# EAGLE design Diag64Cart (EAGLE 9.6.2)
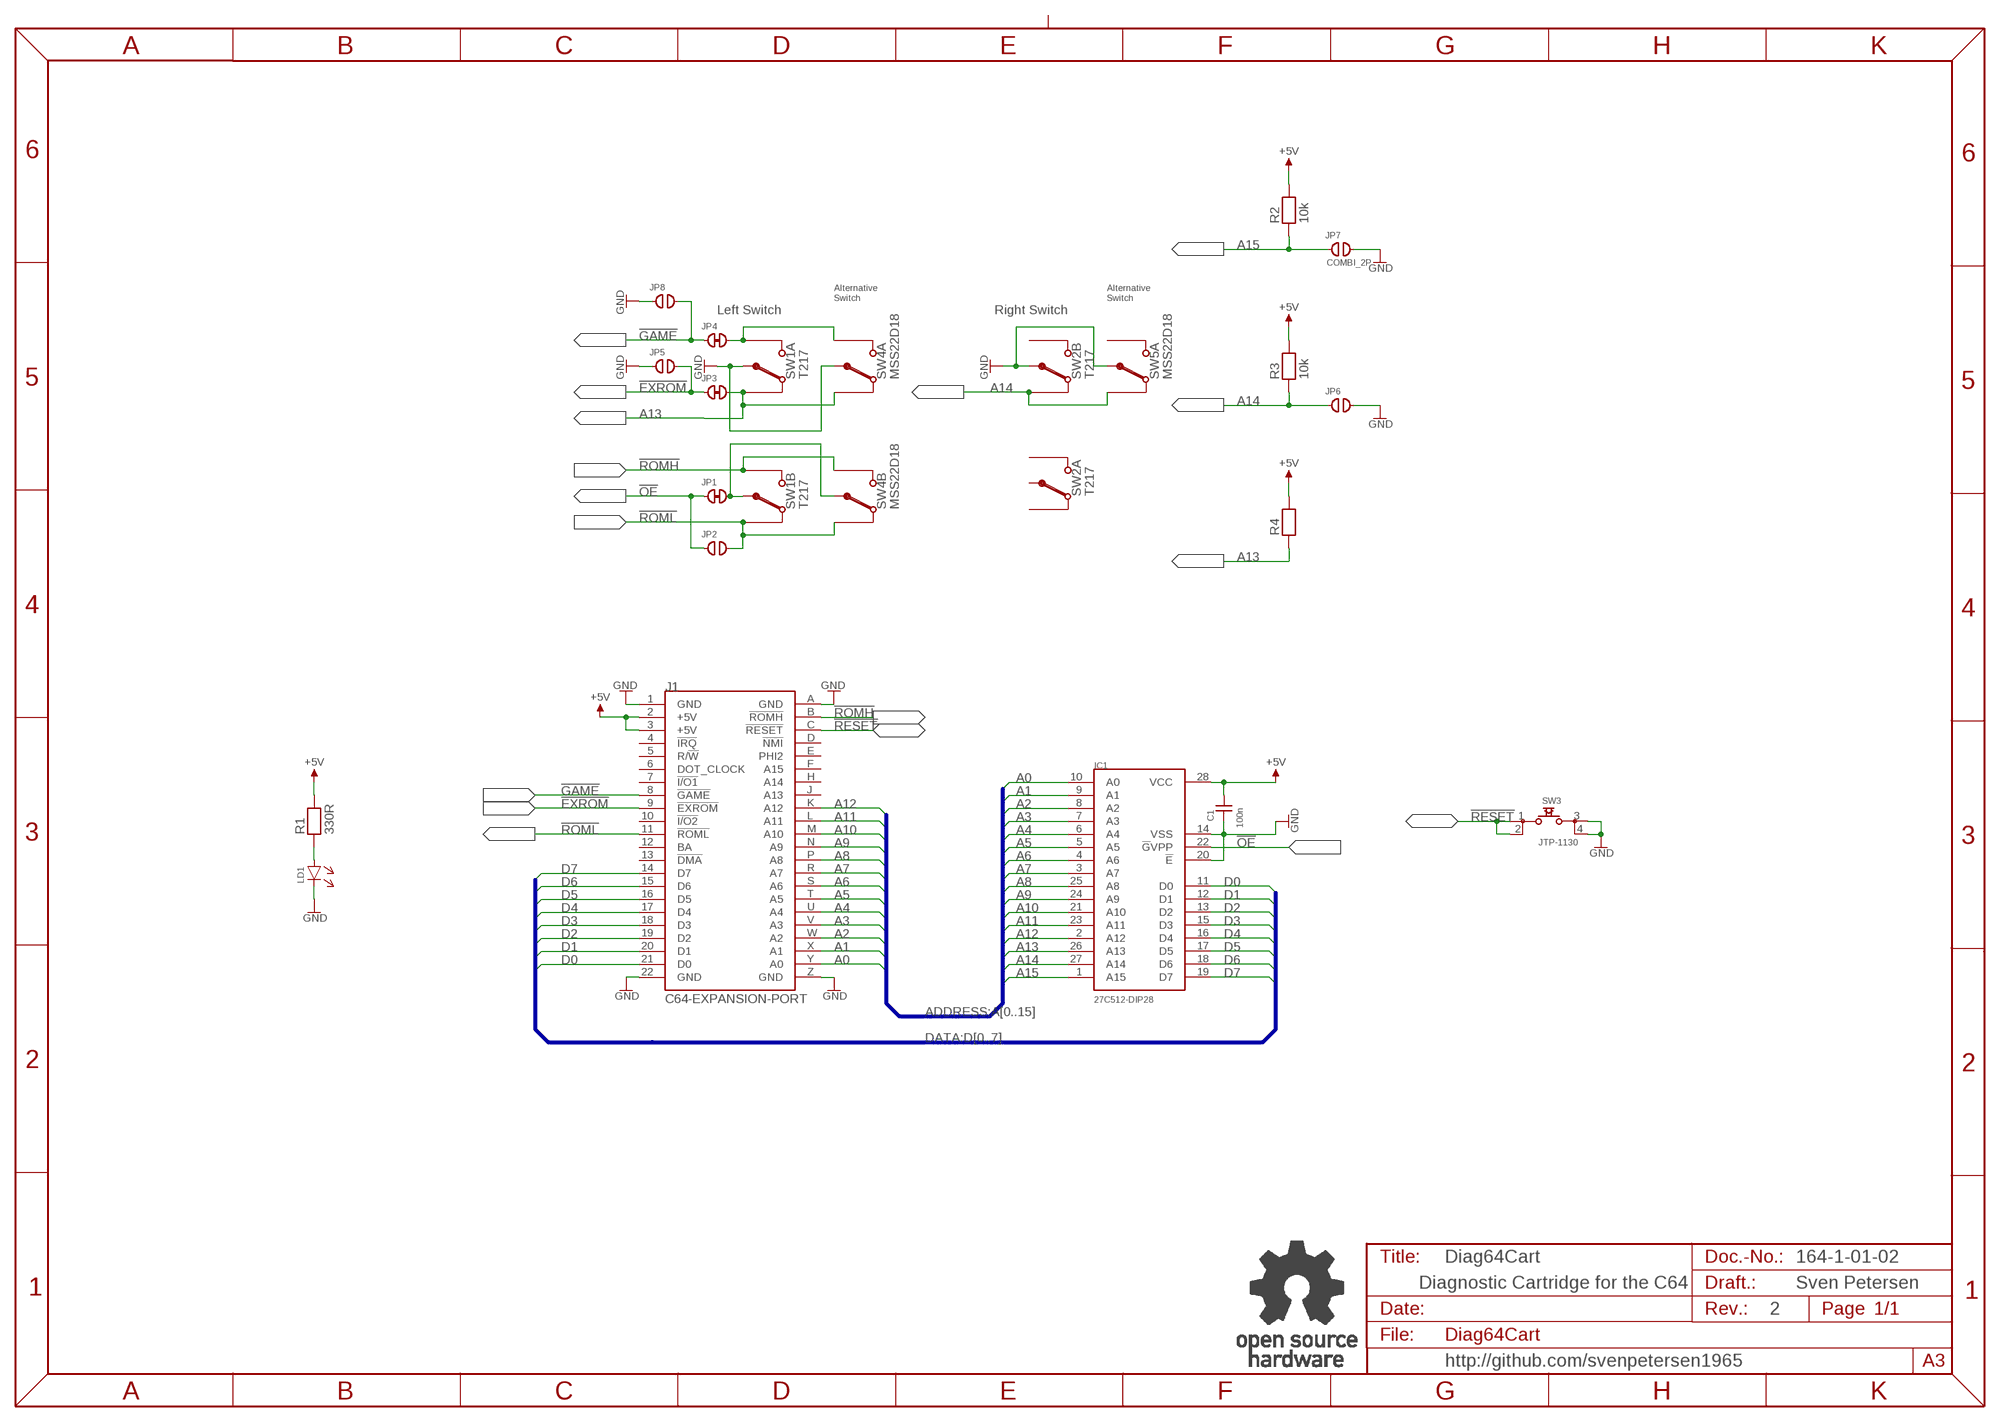
[diagram p0: schematic, sheet 1]

## Parts
C1  100n  CAP01  [C-2,5]
IC1  27C512-DIP28  M27C512-DIP28  [DIL28-6]
J1  C64-EXPANSION-PORT  C64-EXPANSIONPNARROW  [EXPANSIO_SQ]
JP1  CLOSED  [CP_CL]
JP2  OPEN  [CP_OP]
JP3  CLOSED  [CP_CL]
JP4  CLOSED  [CP_CL]
JP5  OPEN  [CP_OP]
JP6  OPEN  [CP_OP]
JP7  COMBI_2P  [COMBI-2P]
JP8  OPEN  [CP_OP]
LD1  3MM  [3MM]
R1  330R  RES04  [R-10]
R2  10k  RES04  [R-10]
R3  10k  RES04  [R-10]
R4  10k  RES04  [R-10]
SW1  T217  [T217_SIDE]
SW2  T217  [T217_SIDE]
SW3  JTP-1130  [JTP-1130]
SW4  MSS22D18  DPDT_9MM  [DPDT_9MM]
SW5  MSS22D18  DPDT_9MM  [DPDT_9MM]
U$43  OPEN_SOURCE_HW  [OPENHW]

## Nets
!EXROM: J1.9(!EXROM) JP3.1 JP5.2
!GAME: J1.8(!GAME) JP4.1 JP8.2
!OE: IC1.22(!G!VPP) JP1.1 JP2.1
!RESET: J1.C(!RESET) SW3.1 SW3.2
!ROMH: J1.B(!ROMH) SW1.UP2(B:UP) SW4.6(B:UP)
!ROML: J1.11(!ROML) JP2.2 SW1.DWN2(B:DWN) SW4.4(B:DWN)
+5V: C1.2 IC1.28(VCC) J1.2(+5V) J1.3(+5V) R1.2 R2.2 R3.2 R4.2
A0: IC1.10(A0) J1.Y(A0)
A1: IC1.9(A1) J1.X(A1)
A2: IC1.8(A2) J1.W(A2)
A3: IC1.7(A3) J1.V(A3)
A4: IC1.6(A4) J1.U(A4)
A5: IC1.5(A5) J1.T(A5)
A6: IC1.4(A6) J1.S(A6)
A7: IC1.3(A7) J1.R(A7)
A8: IC1.25(A8) J1.P(A8)
A9: IC1.24(A9) J1.N(A9)
A10: IC1.21(A10) J1.M(A10)
A11: IC1.23(A11) J1.L(A11)
A12: IC1.2(A12) J1.K(A12)
A13: IC1.26(A13) JP3.2 R4.1 SW1.DWN1(A:DWN) SW4.3(A:DWN)
A14: IC1.27(A14) JP6.1 R3.1 SW2.DWN2(B:DWN) SW5.3(A:DWN)
A15: IC1.1(A15) JP7.1 R2.1
D0: IC1.11(D0) J1.21(D0)
D1: IC1.12(D1) J1.20(D1)
D2: IC1.13(D2) J1.19(D2)
D3: IC1.15(D3) J1.18(D3)
D4: IC1.16(D4) J1.17(D4)
D5: IC1.17(D5) J1.16(D5)
D6: IC1.18(D6) J1.15(D6)
D7: IC1.19(D7) J1.14(D7)
GND: C1.1 IC1.14(VSS) IC1.20(!E) J1.1(GND) J1.22(GND) J1.A(GND) J1.Z(GND) JP5.1 JP6.2 JP7.2 JP8.1 LD1.C(K) SW1.COM1(A:COM) SW2.COM2(B:COM) SW3.3 SW3.4 SW4.2(A:COM) SW5.2(A:COM)
N$1: JP4.2 SW1.UP1(A:UP) SW4.1(A:UP)
N$2: LD1.A R1.1
N$3: JP1.2 SW1.COM2(B:COM) SW4.5(B:COM)
Unconnected: J1.4(!IRQ) J1.5(R/!W) J1.6(DOT_CLOCK) J1.7(!I/O1) J1.10(!I/O2) J1.12(BA) J1.13(!DMA) J1.D(!NMI) J1.E(PHI2) J1.F(A15) J1.H(A14) J1.J(A13) SW2.COM1(A:COM) SW2.DWN1(A:DWN) SW2.UP1(A:UP) SW2.UP2(B:UP) SW5.1(A:UP) SW5.4(B:DWN) SW5.5(B:COM) SW5.6(B:UP)

## Buses
DATA:D[0..7]
ADDRESS:A[0..15]

## Notes on the sheet
- Alternative
  Switch
- Alternative
  Switch
- Left Switch | Right Switch
- Diag64Cart | 164-1-01-02
- Diagnostic Cartridge for the C64 | Sven Petersen
- 2
- http://github.com/svenpetersen1965

## Library data of the parts
C1 = DISCRETE:CAP01
IC1 = ST:M27C512
J1 = Commodore:C64-EXPANSIONP
JP1 JP3 JP4 = Cutpad:CLOSED: Closed Cutpad
JP2 JP5 JP6 JP8 = Cutpad:OPEN: open Cutpad
JP7 = Cutpad:COMBI_2P
LD1 = LED:3MM
R1-R4 = DISCRETE:RES04
SW1 SW2 = wentronic:T217
SW3 = Namae_Electronics:JTP-1130
SW4 SW5 = switches:DPDT_9MM
U$43 = Logo:OPEN_SOURCE_HW

## Board
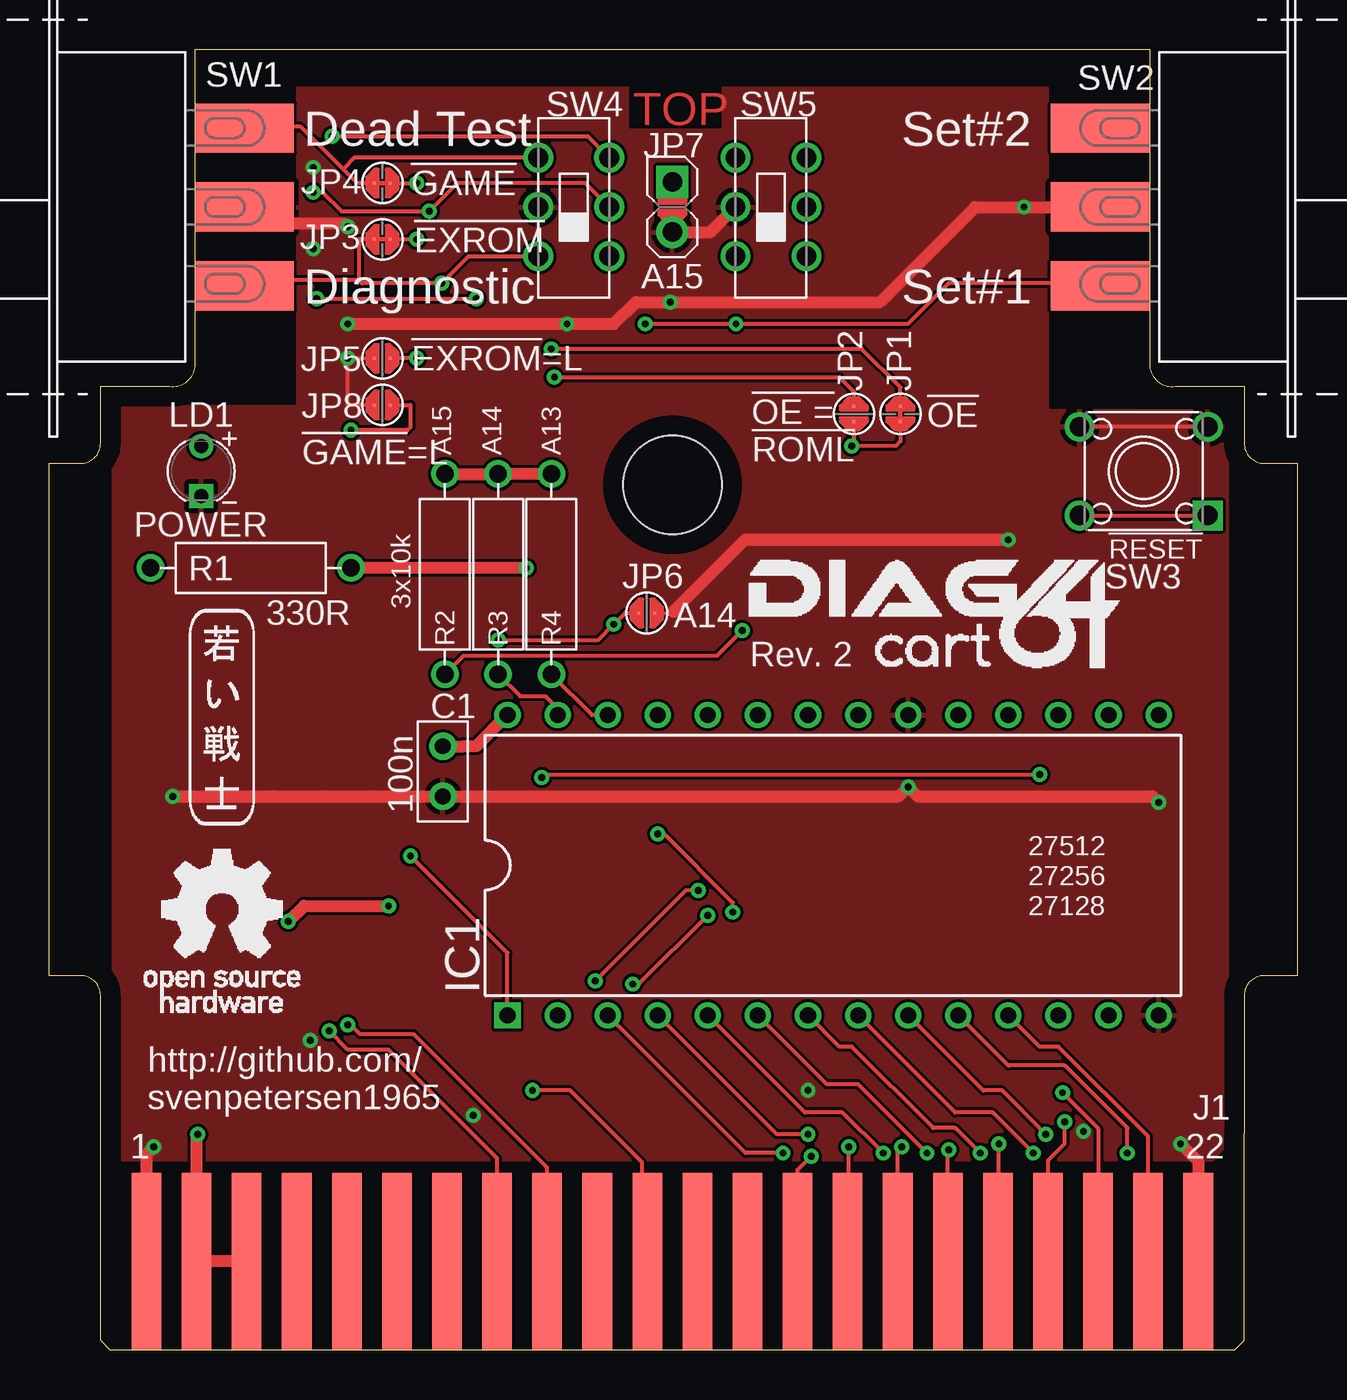
[diagram p1: board, top side]
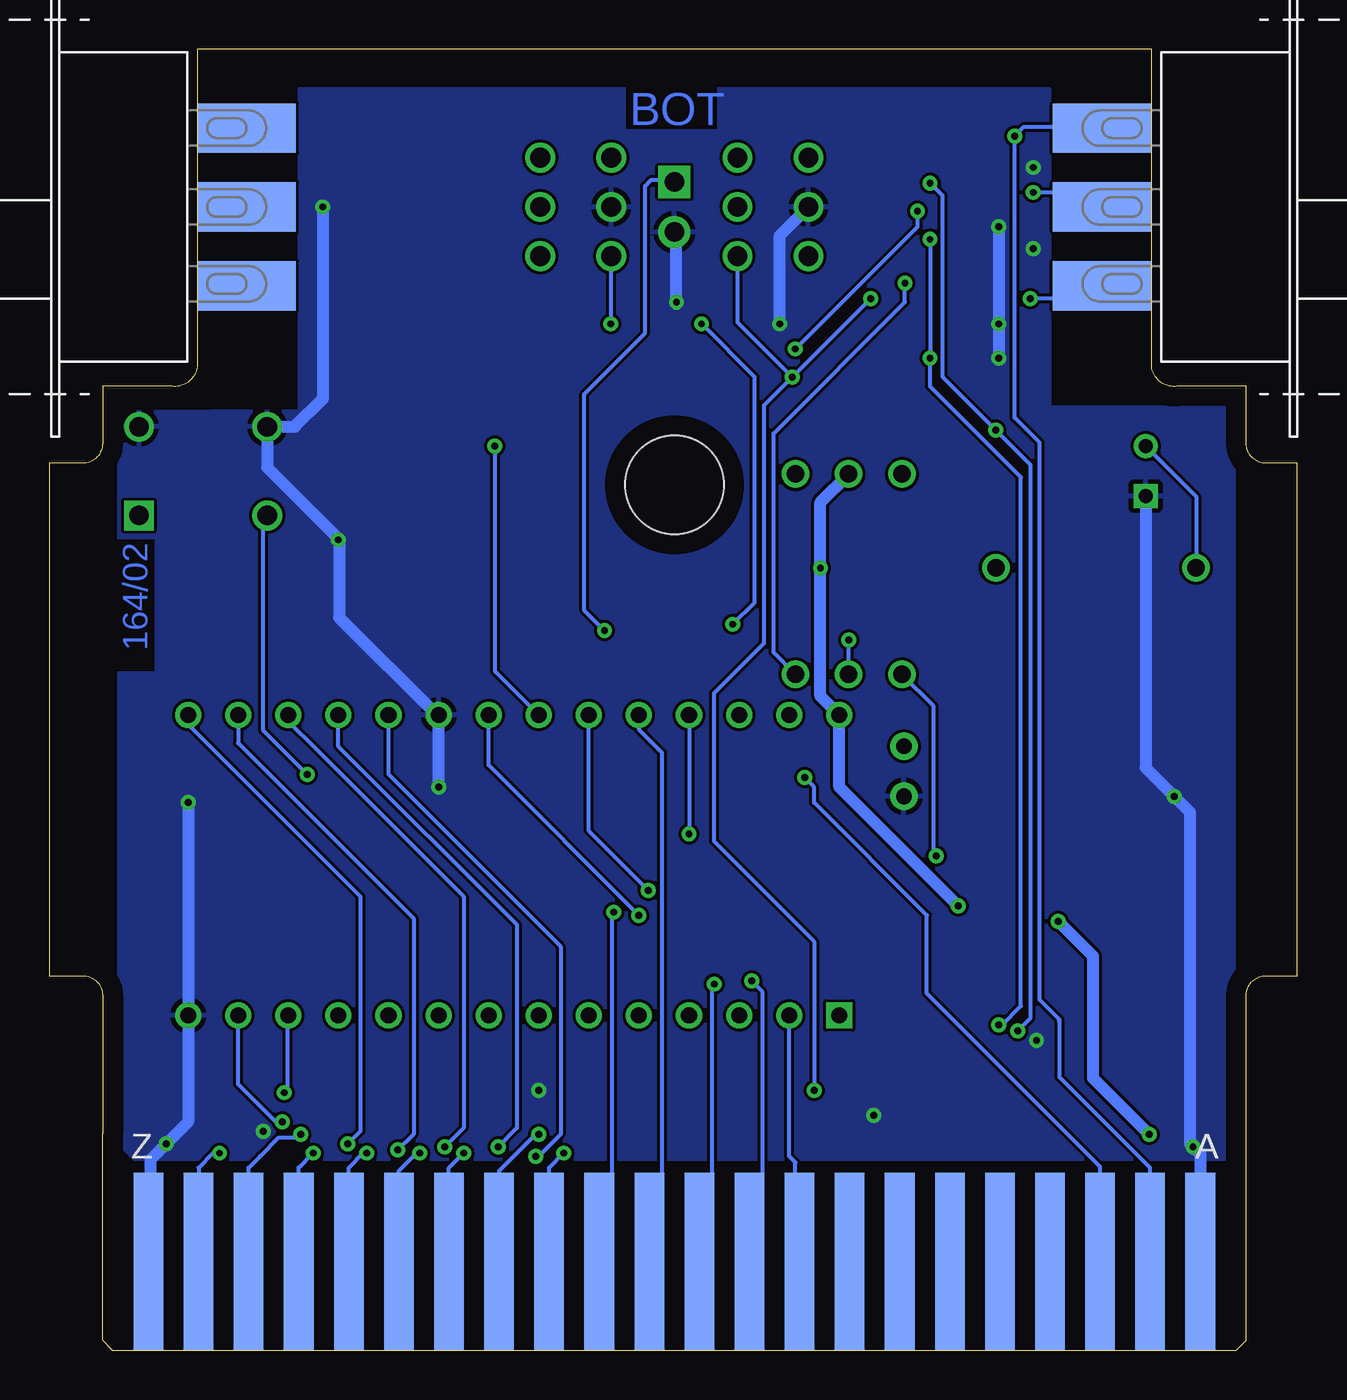
[diagram p2: board, bottom side, seen from below]

Size 63.3 x 66 mm. Coordinates in mm from the lower left corner, seen from the top.
Outline: 2.6,11 2.6,18 arc90 1.6,19 0,19 0,45 1.6,45 arc90 2.6,46 2.6,48.9 6.1,48.9 arc90 7.4,49.9 7.4,66 55.8,66 55.8,49.9 arc90 57.1,48.9 60.6,48.9 60.6,46 arc90 61.6,45 63.3,45 63.3,19 61.6,19 arc90 60.6,18 60.6,11
Copper layers (1*16): Top 0.035mm / dielectric 1.5mm / Bottom 0.035mm
Design rules "default *": minimum track width 6mil, minimum drill 0.35mm, track to track 6mil, track to pad 6mil, pad to pad 6mil, via to via 6mil, smd to smd 6mil, copper to edge 40mil, drill to drill 6mil, minimum pad ring 10mil, minimum via ring 8mil, stop-mask expansion 4mil, vias tented up to drill 24mil, thermal gap 10mil
Holes 5 mm at 31.6,43.9
bRestrict: 3 lines

### Footprints (pad centres in the part's own frame; a part is rotated, then mirrored left to right if it is on the bottom)
C-2,5 = drill 0.8 pad 1.397: 1 -1.27,0; 2 1.27,0
DIL28-6 = drill 0.813 square: 1 -16.51,-7.62 | drill 0.813: 2 -13.97,-7.62; 3 -11.43,-7.62; 4 -8.89,-7.62; 5 -6.35,-7.62; 6 -3.81,-7.62; 7 -1.27,-7.62; 8 1.27,-7.62; 9 3.81,-7.62; 10 6.35,-7.62; 11 8.89,-7.62; 12 11.43,-7.62; 13 13.97,-7.62; 14 16.51,-7.62; 15 16.51,7.62; 16 13.97,7.62; 17 11.43,7.62; 18 8.89,7.62; 19 6.35,7.62; 20 3.81,7.62; 21 1.27,7.62; 22 -1.27,7.62; 23 -3.81,7.62; 24 -6.35,7.62; 25 -8.89,7.62; 26 -11.43,7.62; 27 -13.97,7.62; 28 -16.51,7.62
EXPANSIO_SQ = smd 1.5 x 9: 1 26.67,-4.5; 2 24.13,-4.5; 3 21.59,-4.5; 4 19.05,-4.5; 5 16.51,-4.5; 6 13.97,-4.5; 7 11.43,-4.5; 8 8.89,-4.5; 9 6.35,-4.5; 10 3.81,-4.5; 11 1.27,-4.5; 12 -1.27,-4.5; 13 -3.81,-4.5; 14 -6.35,-4.5; 15 -8.89,-4.5; 16 -11.43,-4.5; 17 -13.97,-4.5; 18 -16.51,-4.5; 19 -19.05,-4.5; 20 -21.59,-4.5; 21 -24.13,-4.5; 22 -26.67,-4.5 | smd 1.5 x 9 bottom: A 26.67,-4.5; B 24.13,-4.5; C 21.59,-4.5; D 19.05,-4.5; E 16.51,-4.5; F 13.97,-4.5; H 11.43,-4.5; J 8.89,-4.5; K 6.35,-4.5; L 3.81,-4.5; M 1.27,-4.5; N -1.27,-4.5; P -3.81,-4.5; R -6.35,-4.5; S -8.89,-4.5; T -11.43,-4.5; U -13.97,-4.5; V -16.51,-4.5; W -19.05,-4.5; X -21.59,-4.5; Y -24.13,-4.5; Z -26.67,-4.5
CP_CL = smd 0.152 x 0.152: 1 -0.4,0; 2 0.4,0
CP_OP = smd 0.152 x 0.152: 1 -0.4,0; 2 0.4,0
COMBI-2P = drill 1 pad 1.626 square: 1 -1.27,0 | drill 1 pad 1.626: 2 1.27,0
3MM = drill 0.7: A -1.27,0 | drill 0.7 square: C 1.27,0
R-10 = drill 0.889 pad 1.397: 1 -5.08,0; 2 5.08,0
T217_SIDE = smd 5 x 2.5: COM1 3,0; DWN1 3,-4; UP1 3,4 | smd 5 x 2.5 bottom: COM2 3,0; DWN2 3,-4; UP2 3,4
JTP-1130 = drill 1 square: 1 3.25,-2.25 | drill 1: 2 -3.25,-2.25; 3 3.25,2.25; 4 -3.25,2.25
DPDT_9MM = drill 1: 1 -1.8,2.5; 2 -1.8,0; 3 -1.8,-2.5; 4 1.8,-2.5; 5 1.8,0; 6 1.8,2.5

### Placement (x,y rotation side)
C1  19.96,29.37 90 top
IC1  39.75,24.61 0 top
J1  31.6,0 180 top
JP1  43.16,47.5 90 top
JP2  40.8,47.5 90 top
JP3  16.89,56.36 180 top
JP4  16.89,59.21 180 top
JP5  16.89,50.32 0 top
JP6  30.3,37.4 0 top
JP7  31.6,58 270 top
JP8  16.89,47.95 0 top
LD1  7.7,44.6 270 top
R1  10.22,39.69 0 top
R2  20.06,39.37 90 top
R3  22.76,39.37 90 top
R4  25.46,39.37 90 top
SW1  6.9,58 0 top
SW2  56.3,58 0 bottom
SW3  55.5,44.6 0 top
SW4  26.6,58 0 top
SW5  36.6,58 0 top
U$26  [DIAG64CART]  35.51,34.65 0 top
U$40  [2LAYER]  29.6,62.16 0 top
U$41  [PCB-TITLE/]  2.64,88.5 0 top  (outside the outline)
U$42  [SVEN_TAG]  8.79,32.23 0 top
U$43  4.82,17.14 0 top

### Tracks (layer width: path | path; a pad name or v marks a point on that pad's centre or on a via)
!EXROM  (via drill 0.35)
  Top 0.203: J1.9 25.25,9.26 18.48,16.03 15.78,16.03 15.3,16.51 v15.14,16.51 | v18.63,50.32 17.58,50.32 JP5.2 | JP3.1 v18.63,56.36
  Bottom 0.203: v15.14,16.51 14.98,16.51 14.03,17.46 14.03,44.29 18.63,48.9 v18.63,50.32 v18.63,56.36
!GAME  (via drill 0.35)
  Top 0.203: J1.8 22.71,9.73 17.21,15.24 15.14,15.24 v14.19,16.19 | JP4.1 v18.63,59.21 | JP8.2 18.31,47.95 18.32,47.94 18.32,46.83 18.16,46.67 v15.3,46.67
  Bottom 0.203: v14.19,16.19 13.55,16.83 13.55,44.93 v15.3,46.67 18,49.37 18,58.58 v18.63,59.21
!OE  (via drill 0.35)
  Top 0.203: JP2.1 40.8,45.98 v40.7,45.88 42.92,45.88 43.16,46.12 JP1.1
  Bottom 0.203: v40.7,45.88 40.7,34.45 IC1.22
!RESET  (via drill 0.35)
  Top 0.203: SW3.2 SW3.1 | v24.98,29.05 25.14,29.21 v50.23,29.21
  Bottom 0.2: 18.79,22.07 24.51,27.78 24.51,28.57
  Bottom 0.203: J1.C 10.01,9.31 18.79,18.1 18.79,22.07 | 24.51,28.57 v24.98,29.05 | v50.23,29.21 52.45,31.43 52.45,42.15 SW3.2
!ROMH  (via drill 0.35)
  Top 0.203: v14.35,61.59 27.3,61.59 SW4.6
  Bottom 0.203: J1.B 7.47,9.26 12.07,13.87 12.07,16.67 12.07,16.78 13.08,17.78 13.08,46.04 14.35,47.31 14.35,61.44 v14.35,61.59 13.87,62.07 9.97,62.07 SW1.UP2
!ROML  (via drill 0.35)
  Top 0.203: J1.11 30.06,4.77 30.06,9.53 26.41,13.18 v24.51,13.18 | v13.55,53.34 v21.65,53.34 | JP2.2 40.8,48.64 40.07,49.37 v25.62,49.37
  Bottom 0.2: 29.59,33.34 29.59,25.82 24.51,20.74 v24.51,13.18
  Bottom 0.203: SW1.DWN2 10.56,53.34 v13.55,53.34 | v21.65,53.34 v25.62,49.37 | v25.62,49.37 27.05,47.94 27.05,35.88 29.59,33.34 | SW4.4 28.4,52.15 v25.62,49.37
+5V  (via drill 0.35)
  Top 0.61: v7.52,10.95 7.47,10.9 J1.2 J1.3 | IC1.28 21.65,30.64 21.02,30.64 C1.2 | R4.2 R3.2 R2.2 | v12.12,21.75 12.92,22.54 v17.21,22.54 | v24.19,39.69 R1.2
  Bottom 0.61: v7.52,10.95 10.38,13.81 10.38,17.78 10.38,20 v12.12,21.75 | R3.2 24.19,43.02 v24.19,39.69 24.19,33.18 IC1.28 23.24,28.57 v17.21,22.54
A0  (via drill 0.35)
  Top 0.203: IC1.10 48.64,14.45 51.5,14.45 54.67,11.27 v54.67,10
  Bottom 0.203: v54.67,10 54.99,10 55.73,9.26 J1.Y
A1  (via drill 0.35)
  Top 0.203: v50.54,10.95 48.32,13.18 47.37,13.18 IC1.9
  Bottom 0.203: J1.X 53.19,9.26 52.61,9.84 51.65,10.79 50.86,10.79 50.7,10.95 v50.54,10.95
A2  (via drill 0.35)
  Top 0.203: v49.91,10 47.84,12.06 45.94,12.06 IC1.8
  Bottom 0.203: J1.W 50.65,9.26 v49.91,10
A3  (via drill 0.35)
  Top 0.203: IC1.7 40.07,15.4 40.7,15.4 44.83,11.27 45.94,11.27 v47.21,10
  Bottom 0.203: J1.V 48.11,9.26 47.37,10 v47.21,10
A4  (via drill 0.35)
  Top 0.203: v44.51,10 41.02,13.49 39.43,13.49 IC1.6
  Bottom 0.203: J1.U 45.57,9.1 44.67,10 v44.51,10
A5  (via drill 0.35)
  Top 0.203: v42.29,10 40.22,12.06 38.32,12.06 IC1.5
  Bottom 0.203: J1.T 43.03,9.26 v42.29,10
A6  (via drill 0.35)
  Top 0.203: v38.48,10.95 36.89,10.95 IC1.4
  Bottom 0.203: J1.S 40.49,9.1 39.11,10.48 38.64,10.95 v38.48,10.95
A7  (via drill 0.35)
  Top 0.203: v37.21,10 35.3,10 IC1.3
  Bottom 0.203: J1.R 37.95,9.26 v37.21,10
A8  (via drill 0.35)
  Top 0.203: v34.67,22.23 34.67,22.7 31.18,26.19 v30.86,26.19
  Bottom 0.203: v34.67,22.23 34.77,22.12 34.77,5.13 J1.P | IC1.25 v30.86,26.19
A9
  Bottom 0.203: J1.N 32.23,5.13 32.23,30.32 33.4,31.48 IC1.24
A10  (via drill 0.35)
  Top 0.203: v33.4,22.07 29.91,18.57 v29.59,18.57
  Bottom 0.203: v29.59,18.57 29.7,18.47 29.7,5.13 J1.M | v33.4,22.07 41.02,29.69 IC1.21
A11  (via drill 0.35)
  Top 0.203: v32.92,23.34 32.29,23.34 v27.68,18.73
  Bottom 0.203: v27.68,18.73 27.16,18.2 27.16,5.13 J1.L | IC1.23 35.94,26.35 v32.92,23.34
A12
  Bottom 0.203: J1.K 25.46,4.71 25.46,9.53 25.78,9.84 IC1.2
A13  (via drill 0.35)
  Top 0.203: SW1.DWN1 10.19,54.29 15.69,54.29 | JP3.2 15.69,56.36 15.69,54.29 | IC1.26 27.52,32.23 R4.1 | 15.69,54.29 15.85,54.13 v19.9,54.13 21.27,55.5 SW4.3
  Bottom 0.203: R4.1 26.57,35.4 26.57,46.51 19.9,53.18 v19.9,54.13
A14  (via drill 0.35)
  Top 0.203: R3.1 23.87,33.18 25.14,33.18 25.78,32.54 IC1.27 | JP6.1 29.21,37.4 v28.64,36.83 27.84,36.04 v22.76,36.04 | v30.22,52.07 v34.83,52.07 43.56,52.07 45.62,54.13 53.17,54.13 SW2.DWN2
  Bottom 0.203: R3.1 v22.76,36.04 | v28.64,36.83 27.52,37.94 27.52,49.37 v30.22,52.07 | SW5.3 34.83,55.47 v34.83,52.07
A15  (via drill 0.35)
  Top 0.2: IC1.1 23.24,20.16 v18.32,25.08
  Top 0.203: R2.1 21.02,35.24 33.87,35.24 v35.14,36.51
  Bottom 0.203: R2.1 18.48,32.7 18.48,25.08 v18.32,25.08 | v35.14,36.51 36.17,37.54 36.17,48.5 33.08,51.59 33.08,59.05 32.76,59.37 31.7,59.37 JP7.1
D0
  Top 0.203: J1.21 55.73,10.85 51.18,15.4 50.23,15.4 IC1.11
D1  (via drill 0.35)
  Top 0.203: v51.39,13.07 53.19,11.26 J1.20
  Bottom 0.203: v51.39,13.07 51.23,13.23 51.23,16.94 IC1.12
D2  (via drill 0.35)
  Top 0.203: J1.19 50.65,9.63 51.5,10.48 v51.5,11.59
  Bottom 0.203: v51.5,11.59 51.81,11.59 53.72,13.49 IC1.13
D3  (via drill 0.35)
  Top 0.203: J1.18 48.16,4.55 v48.16,10.48
  Bottom 0.203: v48.16,10.48 47.53,11.11 47.53,11.43 47.53,23.02 54.99,30.48 56.26,31.75 IC1.15
D4  (via drill 0.35)
  Top 0.203: J1.17 45.57,9.95 45.62,10 v45.62,10.16
  Bottom 0.203: v45.62,10.16 44.83,10.95 44.83,21.91 53.72,30.8 IC1.16
D5  (via drill 0.35)
  Top 0.203: J1.16 43.03,10.11 v43.24,10.32
  Bottom 0.203: v43.24,10.32 42.29,11.27 42.29,23.02 49.75,30.48 51.18,31.91 IC1.17
D6  (via drill 0.35)
  Top 0.203: J1.15 40.54,4.55 40.54,9.84 v40.54,10.32
  Bottom 0.203: v40.54,10.32 39.59,11.27 39.59,21.59 48.64,30.64 IC1.18
D7  (via drill 0.35)
  Top 0.203: J1.14 37.95,9.16 v38.64,9.84
  Bottom 0.203: v38.64,9.84 38.48,9.84 37.37,10.95 37.37,20.48 46.1,29.21 IC1.19
GND  (via drill 0.35)
  Top 0.203: SW3.3 SW3.4 | SW1.COM1 10.75,57.15 | JP5.1 v15.14,50.32 15.14,47.94 15.15,47.95 JP8.1 | JP6.2 31.59,37.4 31.65,37.47
  Top 0.61: J1.A 4.93,9.95 v5.3,10.32 | v57.37,10.48 58.27,9.58 J1.22 | v6.25,28.1 8.79,28.1 11.33,28.1 13.87,28.1 16.41,28.1 C1.1 43.08,28.1 v43.56,28.57 44.03,28.1 55.94,28.1 v56.26,27.78 | v15.14,56.99 14.98,57.15 10.75,57.15 | v15.14,52.07 v26.25,52.07 28.64,52.07 29.75,53.18 v31.49,53.18 42.13,53.18 46.95,58 v49.43,58 SW2.COM2 | 31.65,37.47 35.3,41.12 v48.64,41.12 | JP7.2 33.53,56.73 SW5.2
  Bottom 0.61: J1.A 4.93,9.95 v5.3,10.32 5.46,10.48 5.46,27.3 v6.25,28.1 7.7,29.55 LD1.C | J1.22 58.16,4.61 58.16,9.68 v57.37,10.48 56.26,11.59 IC1.14 v56.26,27.78 | v43.56,28.57 IC1.20 43.61,32.23 48.6,37.18 48.6,41.13 52.25,44.79 SW3.4 50.84,46.85 49.43,48.26 v49.43,58 | v15.14,56.99 v15.14,52.07 v15.14,50.32 | v26.25,52.07 26.25,56.55 SW4.2 | v31.49,53.18 31.49,56.62 JP7.2
  other vias: 21.49,11.91 38.48,13.18 13.24,15.72 52.45,11.11 13.39,55.88 13.39,60.01
  pour Top: 3.24,47.85 3.24,10 3.55,9.68 58.96,9.68 59.75,10.48 59.75,47.62 50.6,47.66 50.6,64 12.6,64 12.6,47.85
  pour Bottom: 3.24,47.85 3.24,10 3.55,9.68 58.96,9.68 59.75,10.48 59.75,47.62 50.6,47.66 50.6,64 12.6,64 12.6,47.85
N$1
  Top 0.203: JP4.2 15.62,59.21 14.9,59.93 | 14.9,59.93 12.76,62.07 9.97,62.07 SW1.UP1 | SW4.1 15.47,60.5 14.9,59.93
N$2
  Bottom 0.203: LD1.A 5.14,43.31 R1.1
N$3  (via drill 0.35)
  Top 0.203: v13.39,58.74 13.87,58.74 14.82,57.78 v19.27,57.78 20.7,59.21 27.19,59.21 SW4.5 | JP1.2 43.16,48.85 41.22,50.8 27.21,50.8 v25.46,50.8
  Bottom 0.203: SW1.COM2 10.64,58.74 v13.39,58.74 | v25.46,50.8 19.27,56.99 v19.27,57.78

### Text on the board
Bottom: 164/02
tPlace: Dead Test | Set#2 | !GAME | !EXROM | A15 | Diagnostic | Set#1 | !EXROM!=L | !OE = / !ROML | !OE | !GAME!=L | A15 | A14 | A13 | POWER | !RESET | 3x10k | 330R | A14 | Rev. 2 | 100n | 27512 / 27256 / 27128 | http://github.com/ / svenpetersen1965
Measures: 5.0
Document: 164-2-01-02 | Sven Petersen / 2021 | 35µm | 2 | 2